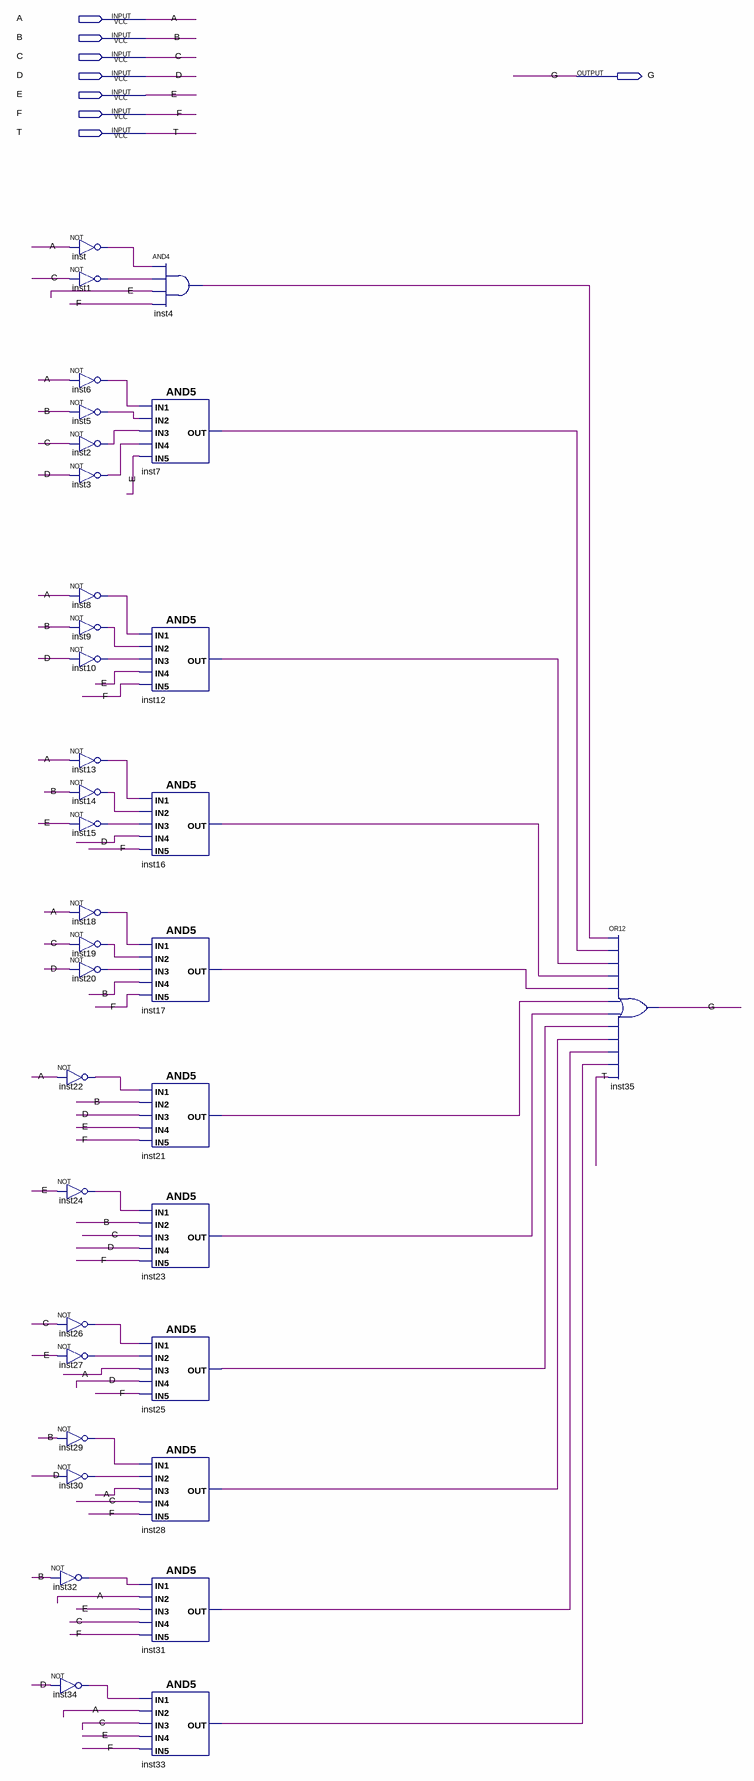
[diagram p0: schematic sheet]
// Quartus schematic prime_extension.bdf as structural Verilog: 35 symbols, 8 pins
module prime_extension (
  input  A,
  input  B,
  input  C,
  input  D,
  input  E,
  input  F,
  input  T,
  output G
);

  wire inst1_out, inst2_out, inst3_out, inst4_out, inst5_out, inst6_out, inst7_out, inst8_out, inst9_out,
       inst10_out, inst12_out, inst13_out, inst14_out, inst15_out, inst16_out, inst17_out, inst18_out,
       inst19_out, inst20_out, inst21_out, inst22_out, inst23_out, inst24_out, inst25_out, inst26_out,
       inst27_out, inst28_out, inst29_out, inst30_out, inst31_out, inst32_out, inst33_out, inst34_out,
       inst_out;

  not inst22 (inst22_out, A);
  not inst24 (inst24_out, E);
  not inst26 (inst26_out, C);
  not inst27 (inst27_out, E);
  not inst29 (inst29_out, B);
  not inst30 (inst30_out, D);
  not inst32 (inst32_out, B);
  not inst34 (inst34_out, D);
  not inst (inst_out, A);
  not inst1 (inst1_out, C);
  not inst6 (inst6_out, A);
  not inst5 (inst5_out, B);
  not inst2 (inst2_out, C);
  not inst3 (inst3_out, D);
  not inst8 (inst8_out, A);
  not inst9 (inst9_out, B);
  not inst10 (inst10_out, D);
  not inst13 (inst13_out, A);
  not inst14 (inst14_out, B);
  not inst15 (inst15_out, E);
  not inst18 (inst18_out, A);
  not inst19 (inst19_out, C);
  not inst20 (inst20_out, D);
  and inst4 (inst4_out, inst_out, inst1_out, E, F);
  and inst7 (inst7_out, inst6_out, inst5_out, inst2_out, inst3_out, E);
  and inst12 (inst12_out, inst8_out, inst9_out, inst10_out, E, F);
  and inst16 (inst16_out, inst13_out, inst14_out, inst15_out, D, F);
  and inst17 (inst17_out, inst18_out, inst19_out, inst20_out, B, F);
  and inst21 (inst21_out, inst22_out, B, D, E, F);
  and inst23 (inst23_out, inst24_out, B, C, D, F);
  and inst25 (inst25_out, inst26_out, inst27_out, A, D, F);
  and inst28 (inst28_out, inst29_out, inst30_out, A, C, F);
  and inst31 (inst31_out, inst32_out, A, E, C, F);
  and inst33 (inst33_out, inst34_out, A, C, E, F);
  or inst35 (G, inst4_out, inst7_out, inst12_out, inst16_out, inst17_out, inst21_out, inst23_out, inst25_out, inst28_out, inst31_out, inst33_out, T);
endmodule
